# EAGLE design sensing_unit_rev3 (EAGLE 8.4.0)
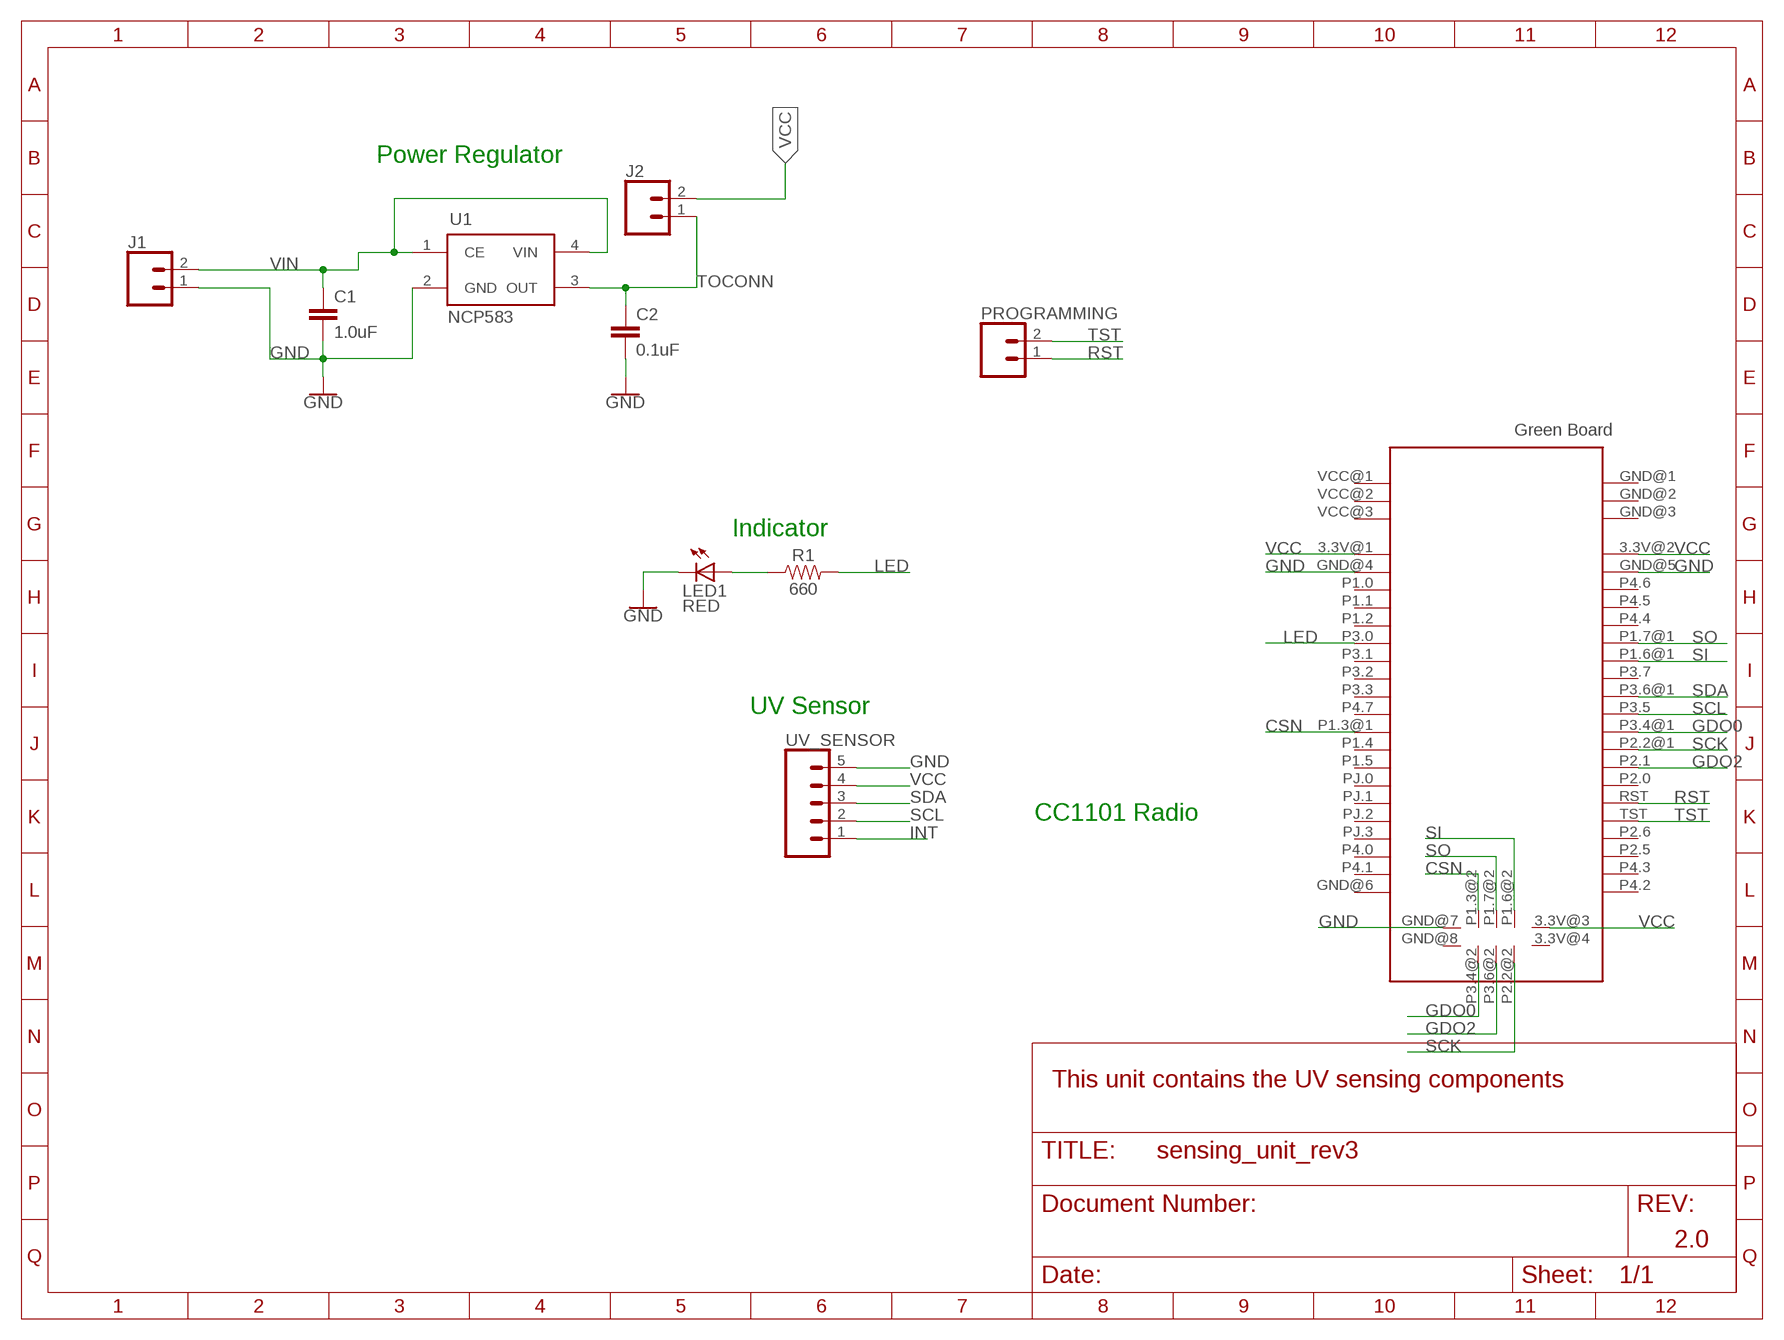
[diagram p0: schematic, sheet 1]

## Parts
C1  1.0uF  1.0UF-0805-25V-(+80/-20%)  [0805]
C2  0.1uF  1.0UF-0805-25V-(+80/-20%)  [0805]
J1  CONN_02  [1X02]
J2  CONN_02  [1X02]
LED1  RED  LEDCHIP-LED0805  [CHIP-LED0805]
PROGRAMMING  CONN_02  [1X02]
R1  660  RESISTOR0805  [0805]
U1  NCP583  [SC82-AB_1PRIMARY]
U$1  GREEDNBRD  [GREENBRD]
UV_SENSOR  CONN_05  [1X05]

## Nets
CSN: U$1.P1.3@1(P1.3) U$1.P1.3@2(P1.3)
GDO0: U$1.P3.4@1(P3.4) U$1.P3.4@2(P3.4)
GDO2: U$1.P2.1 U$1.P3.6@2(P3.6)
GND: C1.2 C2.2 J1.1 LED1.C U1.2(GND) U$1.GND@4(GND) U$1.GND@5(GND) U$1.GND@7(GND) UV_SENSOR.5
INT: UV_SENSOR.1
LED: R1.2 U$1.P3.0
N$2: LED1.A R1.1
RST: PROGRAMMING.1 U$1.RST
SCK: U$1.P2.2@1(P2.2) U$1.P2.2@2(P2.2)
SCL: U$1.P3.5 UV_SENSOR.2
SDA: U$1.P3.6@1(P3.6) UV_SENSOR.3
SI: U$1.P1.6@1(P1.6) U$1.P1.6@2(P1.6)
SO: U$1.P1.7@1(P1.7) U$1.P1.7@2(P1.7)
TOCONN: C2.1 J2.1 U1.3(OUT)
TST: PROGRAMMING.2 U$1.TST
VCC: J2.2 U$1.3.3V@1(3.3V) U$1.3.3V@2(3.3V) U$1.3.3V@3(3.3V) UV_SENSOR.4
VIN: C1.1 J1.2 U1.1(CE) U1.4(VIN)
Unconnected: U$1.3.3V@4(3.3V) U$1.GND@1(GND) U$1.GND@2(GND) U$1.GND@3(GND) U$1.GND@6(GND) U$1.GND@8(GND) U$1.P1.0 U$1.P1.1 U$1.P1.2 U$1.P1.4 U$1.P1.5 U$1.P2.0 U$1.P2.5 U$1.P2.6 U$1.P3.1 U$1.P3.2 U$1.P3.3 U$1.P3.7 U$1.P4.0 U$1.P4.1 U$1.P4.2 U$1.P4.3 U$1.P4.4 U$1.P4.5 U$1.P4.6 U$1.P4.7 U$1.PJ.0 U$1.PJ.1 U$1.PJ.2 U$1.PJ.3 U$1.VCC@1(VCC) U$1.VCC@2(VCC) U$1.VCC@3(VCC)

## Notes on the sheet
- Power Regulator
- Indicator
- UV Sensor
- CC1101 Radio
- This unit contains the UV sensing components
- 2.0

## Library data of the parts
C1 = SparkFun-Capacitors:1.0UF: 1µF ceramic capacitors A capacitor is a passive two-terminal electrical component used to store electrical energy temporarily in an electric field.; PROD_ID: CAP-11625
C2 = SparkFun-Capacitors:1.0UF: 1µF ceramic capacitors A capacitor is a passive two-terminal electrical component used to store electrical energy temporarily in an electric field.; PROD_ID: CAP-11625; VALUE: 1.0uF
J1 J2 PROGRAMMING = SparkFun-Connectors:CONN_02: Multi connection point. Often used as Generic Header-pin footprint for 0.1 inch spaced/style header connections On any of the 0.1 inch spaced packages, you can populate with these: Break Away Headers - Straight <https://www.sparkfun.com/products/116> (PRT-00116) Break Away Male Headers - Right Angle <https://www.sparkfun.com/products/553> (PRT-00553) Female Headers <https://www.sparkfun.com/products/115> (PRT-00115) Break Away Headers - Machine Pin <https://www.sparkfun.com/products/117> (PRT-00117) Break Away Female Headers - Swiss Machine Pin <https://www.sparkfun.com/products/743> (PRT-00743) For SCREWTERMINALS and SPRING TERMINALS visit here: Screw Terimnals on SparkFun.com <https://www.sparkfun.com/search/results?term=Screw+Terminals> (5mm/3.5mm/2.54mm spacing) This device is also useful as a general connection point to wire up your design to another part of your project. Our various solder wires solder well into these plated through hole pads. Hook-Up Wire - Assortment (Stranded, 22 AWG) <https://www.sparkfun.com/products/11375> (PRT-11375) Hook-Up Wire - Assortment (Solid Core, 22 AWG) <https://www.sparkfun.com/products/11367> (PRT-11367) View the entire wire category on our website here <https://www.sparkfun.com/categories/141> Special notes: Molex polarized connector foot print use with: PRT-08233 with associated crimp pins and housings. 2.54_SCREWTERM for use with PRT-10571. 3.5mm Screw Terminal footprints for PRT-08084 5mm Screw Terminal footprints for use with PRT-08432
LED1 = led:LED: LED OSRAM: - CHIPLED LG R971, LG N971, LY N971, LG Q971, LY Q971, LO R971, LY R971 LH N974, LH R974 LS Q976, LO Q976, LY Q976 LO Q996 - Hyper CHIPLED LW Q18S LB Q993, LB Q99A, LB R99A - SideLED LS A670, LO A670, LY A670, LG A670, LP A670 LB A673, LV A673, LT A673, LW A673 LH A674 LY A675 LS A676, LA A676, LO A676, LY A676, LW A676 LS A679, LY A679, LG A679 - Hyper Micro SIDELED® LS Y876, LA Y876, LO Y876, LY Y876 LT Y87S - SmartLED LW L88C, LW L88S LB L89C, LB L89S, LG L890 LS L89K, LO L89K, LY L89K LS L896, LA L896, LO L896, LY L896 - TOPLED LS T670, LO T670, LY T670, LG T670, LP T670 LSG T670, LSP T670, LSY T670, LOP T670, LYG T670 LG T671, LOG T671, LSG T671 LB T673, LV T673, LT T673, LW T673 LH T674 LS T676, LA T676, LO T676, LY T676, LB T676, LH T676, LSB T676, LW T676 LB T67C, LV T67C, LT T67C, LS T67K, LO T67K, LY T67K, LW E67C LS E67B, LA E67B, LO E67B, LY E67B, LB E67C, LV E67C, LT E67C LW T67C LS T679, LY T679, LG T679 LS T770, LO T770, LY T770, LG T770, LP T770 LB T773, LV T773, LT T773, LW T773 LH T774 LS E675, LA E675, LY E675, LS T675 LS T776, LA T776, LO T776, LY T776, LB T776 LHGB T686 LT T68C, LB T68C - Hyper Mini TOPLED® LB M676 - Mini TOPLED Santana® LG M470 LS M47K, LO M47K, LY M47K Source: http://www.osram.convergy.de LUXEON: - LUMILED® LXK2-PW12-R00, LXK2-PW12-S00, LXK2-PW14-U00, LXK2-PW14-V00 LXK2-PM12-R00, LXK2-PM12-S00, LXK2-PM14-U00 LXK2-PE12-Q00, LXK2-PE12-R00, LXK2-PE12-S00, LXK2-PE14-T00, LXK2-PE14-U00 LXK2-PB12-K00, LXK2-PB12-L00, LXK2-PB12-M00, LXK2-PB14-N00, LXK2-PB14-P00, LXK2-PB14-Q00 LXK2-PR12-L00, LXK2-PR12-M00, LXK2-PR14-Q00, LXK2-PR14-R00 LXK2-PD12-Q00, LXK2-PD12-R00, LXK2-PD12-S00 LXK2-PH12-R00, LXK2-PH12-S00 LXK2-PL12-P00, LXK2-PL12-Q00, LXK2-PL12-R00 Source: www.luxeon.com KINGBRIGHT: KA-3528ASYC Source: www.kingbright.com
R1 = SparkFun-Resistors:RESISTOR: Generic Resistor Package
U1 = ncp583:NCP583: NCP583 - Ultra-Low Iq 150 mA CMOS LDO Regulator with Enable The NCP583 series of low dropout regulators are designed for portable battery powered applications which require precise output voltage accuracy and low quiescent current. These devices feature an enable function which lowers current consumption significantly and are offered in two small packages; SC−82AB and the SOT−563. A 1.0 mF ceramic capacitor is the recommended value to be used with these devices on the output pin.
U$1 = GreenBoard:GREEDNBRD
UV_SENSOR = SparkFun-Connectors:CONN_05: Multi connection point. Often used as Generic Header-pin footprint for 0.1 inch spaced/style header connections On any of the 0.1 inch spaced packages, you can populate with these: Break Away Headers - Straight <https://www.sparkfun.com/products/116> (PRT-00116) Break Away Male Headers - Right Angle <https://www.sparkfun.com/products/553> (PRT-00553) Female Headers <https://www.sparkfun.com/products/115> (PRT-00115) Break Away Headers - Machine Pin <https://www.sparkfun.com/products/117> (PRT-00117) Break Away Female Headers - Swiss Machine Pin <https://www.sparkfun.com/products/743> (PRT-00743) For SCREWTERMINALS and SPRING TERMINALS visit here: Screw Terimnals on SparkFun.com <https://www.sparkfun.com/search/results?term=Screw+Terminals> (5mm/3.5mm/2.54mm spacing) This device is also useful as a general connection point to wire up your design to another part of your project. Our various solder wires solder well into these plated through hole pads. Hook-Up Wire - Assortment (Stranded, 22 AWG) <https://www.sparkfun.com/products/11375> (PRT-11375) Hook-Up Wire - Assortment (Solid Core, 22 AWG) <https://www.sparkfun.com/products/11367> (PRT-11367) View the entire wire category on our website here <https://www.sparkfun.com/categories/141> Special notes: Molex polarized connector foot print use with SKU : PRT-08231 with associated crimp pins and housings. 1MM SMD Version SKU: PRT-10208

## Net classes
0 default: width 0.305 mm, drill 0.508 mm, clearance 0.254 mm

## Board
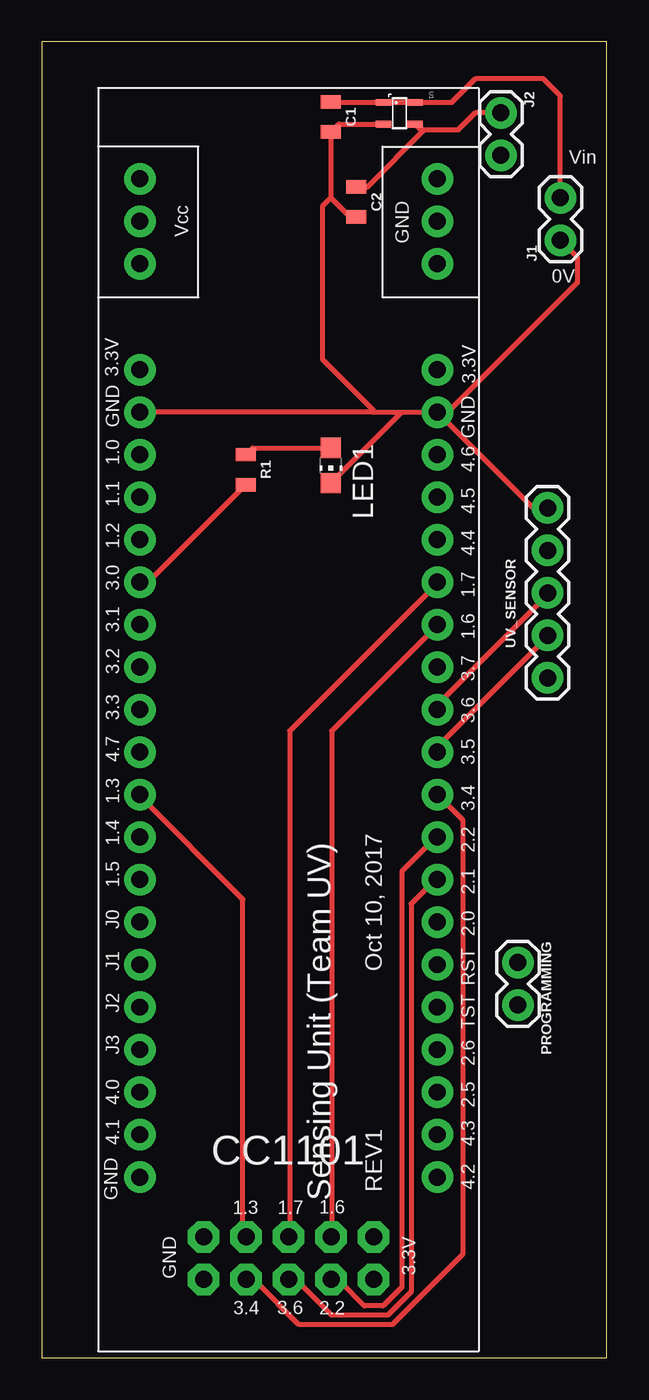
[diagram p1: board, top side]
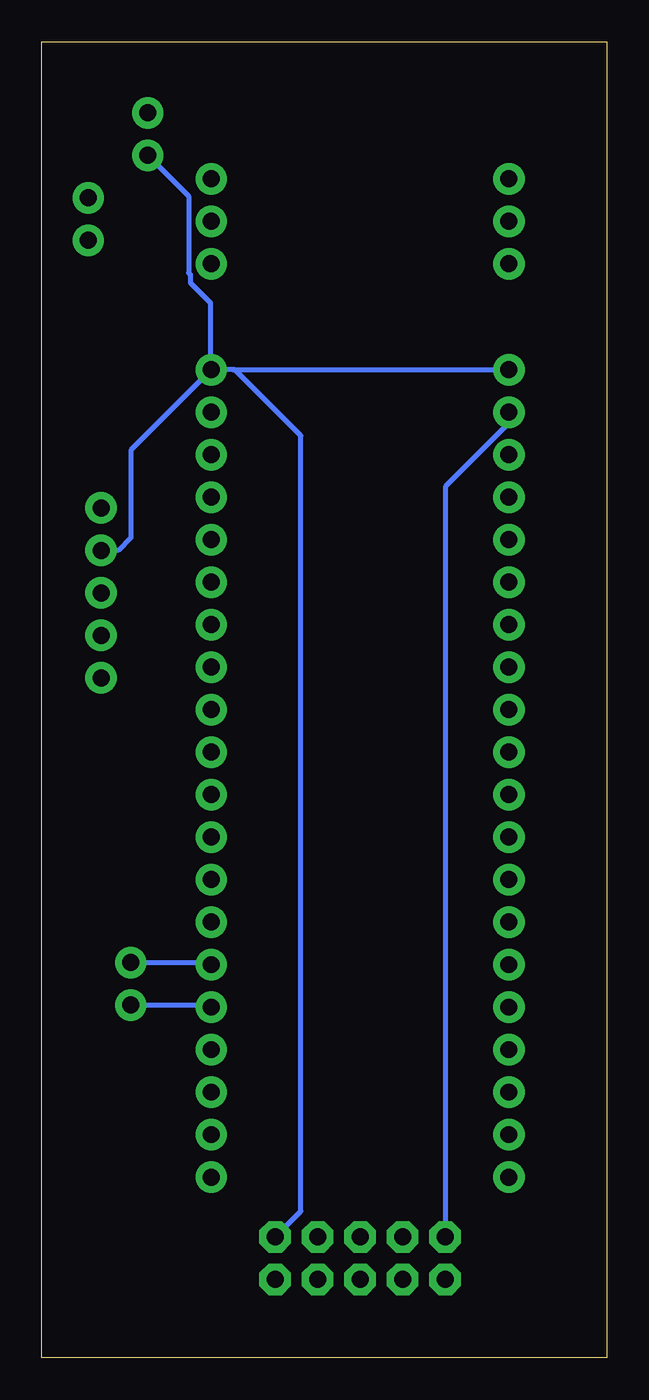
[diagram p2: board, bottom side, seen from below]

Size 33.76 x 78.66 mm. Coordinates in mm from the lower left corner, seen from the top.
Outline: 0,0 33.76,0 33.76,78.66 0,78.66 0,0
Copper layers (1*16): Top 0.0356mm / dielectric 1.5011mm / Bottom 0.0356mm
Design rules "oshpark-2layer": minimum track width 6mil, minimum drill 13mil, track to track 6mil, track to pad 6mil, pad to pad 6mil, via to via 6mil, smd to smd 6mil, copper to edge 15mil, drill to drill 6mil, minimum pad ring 7mil, minimum via ring 7mil, stop-mask expansion 2.5mil, vias tented up to drill 0mil, thermal gap 10mil

### Footprints (pad centres in the part's own frame; a part is rotated, then mirrored left to right if it is on the bottom)
0805 = smd 0.8 x 1.2: 1 -0.9,0; 2 0.9,0
1X02 = drill 1.016 pad 1.88: 1 0,0; 2 2.54,0
CHIP-LED0805 = smd 1.2 x 1.2: A 0,-1.05; C 0,1.05
SC82-AB_1PRIMARY = smd 0.406 x 0.914: 1 -0.621,-0.913; 2 0.675,-0.913; 3 0.675,0.967; 4 -0.621,0.967
GREENBRD = drill 1.015 pad 1.88: 3.3V@1 -8.875,21.21; 3.3V@2 8.905,21.21; GND@1 8.905,32.63; GND@2 8.905,30.09; GND@3 8.905,27.55; GND@4 -8.875,18.67; GND@5 8.905,18.67; GND@6 -8.875,-27.05; P1.0 -8.875,16.13; P1.1 -8.875,13.59; P1.2 -8.875,11.05; P1.3@1 -8.875,-4.19; P1.4 -8.875,-6.73; P1.5 -8.875,-9.27; P1.6@1 8.905,5.97; P1.7@1 8.905,8.51; P2.0 8.905,-11.81; P2.1 8.905,-9.27; P2.2@1 8.905,-6.73; P2.5 8.905,-21.97; P2.6 8.905,-19.43; P3.0 -8.875,8.51; P3.1 -8.875,5.97; P3.2 -8.875,3.43; P3.3 -8.875,0.89; P3.4@1 8.905,-4.19; P3.5 8.905,-1.65; P3.6@1 8.905,0.89; P3.7 8.905,3.43; P4.0 -8.875,-21.97; P4.1 -8.875,-24.51; P4.2 8.905,-27.05; P4.3 8.905,-24.51; P4.4 8.905,11.05; P4.5 8.905,13.59; P4.6 8.905,16.13; P4.7 -8.875,-1.65; PJ.0 -8.875,-11.81; PJ.1 -8.875,-14.35; PJ.2 -8.875,-16.89; PJ.3 -8.875,-19.43; RST 8.905,-14.35; TST 8.905,-16.89; VCC@1 -8.875,32.63; VCC@2 -8.875,30.09; VCC@3 -8.875,27.55 | drill 1.015 pad 1.88 octagon: 3.3V@3 5.095,-30.63; 3.3V@4 5.095,-33.17; GND@7 -5.065,-30.63; GND@8 -5.065,-33.17; P1.3@2 -2.525,-30.63; P1.6@2 2.555,-30.63; P1.7@2 0.015,-30.63; P2.2@2 2.555,-33.17; P3.4@2 -2.525,-33.17; P3.6@2 0.015,-33.17
1X05 = drill 1.016 pad 1.88: 1 0,0; 2 2.54,0; 3 5.08,0; 4 7.62,0; 5 10.16,0

### Placement (x,y rotation side)
C1  17.27,74.17 270 top
C2  18.8,69.09 270 top
J1  30.99,66.8 90 top
J2  27.43,74.42 270 top
LED1  17.27,53.34 180 top
PROGRAMMING  28.45,23.62 270 top
R1  12.19,53.09 270 top
U1  21.34,74.42 270 top
U$1  14.73,37.85 0 top
UV_SENSOR  30.23,40.64 90 top

### Tracks (layer width: path | path; a pad name or v marks a point on that pad's centre or on a via)
CSN
  Top 0.305: U$1.P1.3@1 5.87,33.55 12.01,27.41 12.01,7.29 U$1.P1.3@2
GDO0
  Top 0.305: U$1.P3.4@2 12.29,4.5 12.85,4.5 15.37,1.98 20.95,1.98 25.15,6.17 25.15,32.16 23.75,33.55 U$1.P3.4@1
GDO2
  Top 0.305: U$1.P3.6@2 14.81,4.5 15.37,4.5 17.32,2.54 20.68,2.54 22.07,3.94 22.07,27.13 23.47,28.52 U$1.P2.1
GND
  Top 0.305: LED1.C 21.5,56.52 U$1.GND@5 | 19.81,56.52 U$1.GND@5 | 19.81,56.52 U$1.GND@4 | 17.27,69.34 C1.2 17.75,73.75 U1.2 | 17.27,69.34 18.43,68.19 C2.2 | 23.69,56.46 U$1.GND@5 | 23.69,56.46 29.35,50.8 UV_SENSOR.5 | 23.69,56.46 24.2,56.46 32,64.26 32,65.79 J1.1 | 17.27,69.34 16.76,68.83 16.76,59.69 19.81,56.64 19.81,56.52
  Bottom 0.305: U$1.GND@4 5.86,55.88 7.2,54.53 7.2,54.52 9.65,52.07 9.65,7.23 U$1.GND@7
LED
  Top 0.305: R1.2 6.36,46.36 U$1.P3.0
N$2
  Top 0.305: R1.1 12.6,54.39 LED1.A
RST
  Bottom 0.305: PROGRAMMING.1 23.76,23.62 U$1.RST
SCK
  Top 0.305: U$1.P2.2@2 17.32,4.5 17.88,4.5 19.28,3.1 20.4,3.1 21.51,4.22 21.51,29.08 23.47,31.04 U$1.P2.2@1
SCL
  Top 0.305: UV_SENSOR.2 30.18,43.05 23.47,36.35 U$1.P3.5
SDA
  Top 0.305: UV_SENSOR.3 30.18,45.57 23.47,38.86 U$1.P3.6@1
SI
  Top 0.305: U$1.P1.6@2 17.32,7.29 17.32,37.47 23.47,43.61 U$1.P1.6@1
SO
  Top 0.305: U$1.P1.7@2 14.81,7.29 14.81,37.47 23.47,46.13 U$1.P1.7@1
TOCONN
  Top 0.305: J2.1 25.91,74.42 24.89,73.41 22.86,73.41 | 22.86,73.41 22.64,73.41 U1.3 | C2.1 19.44,69.99 22.86,73.41
TST
  Bottom 0.305: PROGRAMMING.2 23.76,21.08 U$1.TST
VCC
  Bottom 0.305: 22.35,59.06 U$1.3.3V@1 | 22.35,59.06 U$1.3.3V@2 23.69,59 | 23.69,59 28.45,54.25 28.45,49.02 29.21,48.26 UV_SENSOR.4 | J2.2 24.98,69.43 24.98,64.84 24.89,64.75 24.89,64.26 23.69,63.06 23.69,59 | U$1.3.3V@3 18.29,8.76 18.29,55.12 22.23,59.06 22.35,59.06
VIN
  Top 0.305: C1.1 17.3,75.04 U1.1 U1.4 24.5,75.04 25.91,76.45 29.97,76.45 30.99,75.44 J1.2

### Text on the board
tPlace: Vin | 0V | Oct 10, 2017 | Sensing Unit (Team UV) | REV1